# EasyEDA schematic schematic-edited-source.json
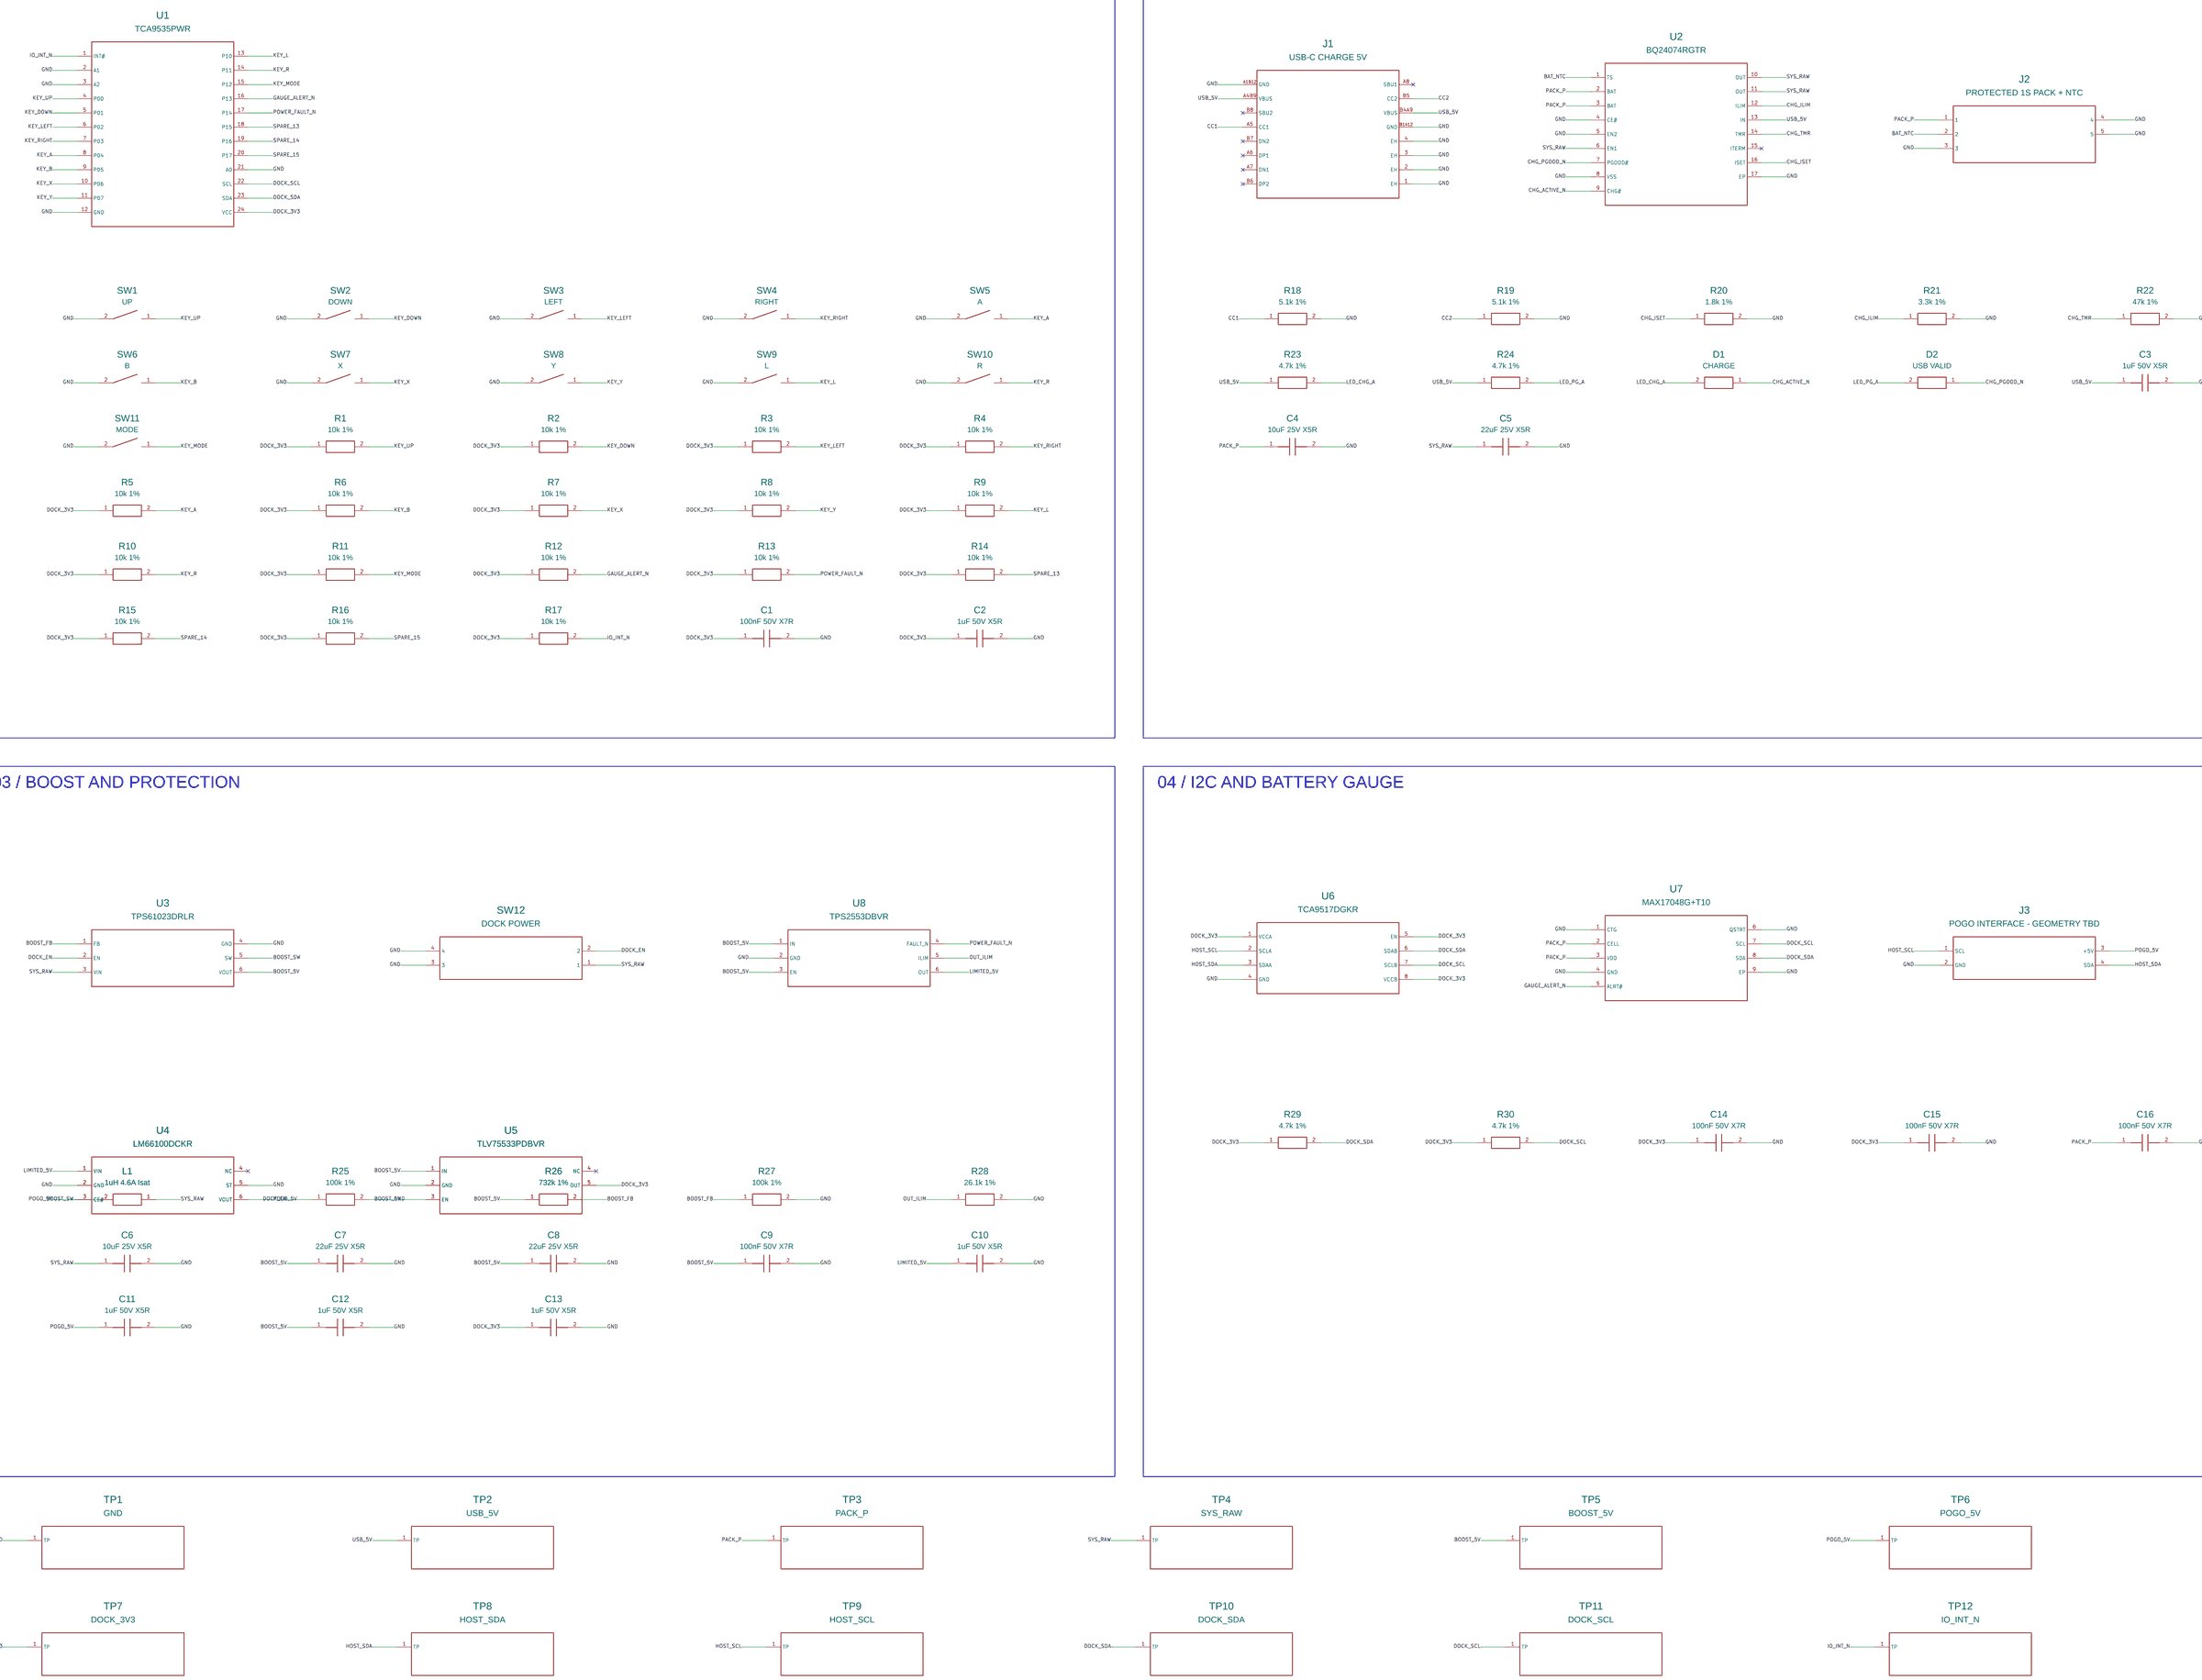
[diagram p0: schematic sheet]

## Parts
C1  100nF 50V X7R  [C0603]
C2  1uF 50V X5R  [C0603]
C3  1uF 50V X5R  [C0603]
C4  10uF 25V X5R  [C0603]
C5  22uF 25V X5R  [C0603]
C6  10uF 25V X5R  [C0603]
C7  22uF 25V X5R  [C0603]
C8  22uF 25V X5R  [C0603]
C9  100nF 50V X7R  [C0603]
C10  1uF 50V X5R  [C0603]
C11  1uF 50V X5R  [C0603]
C12  1uF 50V X5R  [C0603]
C13  1uF 50V X5R  [C0603]
C14  100nF 50V X7R  [C0603]
C15  100nF 50V X7R  [C0603]
C16  100nF 50V X7R  [C0603]
D1  CHARGE  [LED0805-R-RD]
D2  USB VALID  [LED0805-R-RD]
J1  USB-C CHARGE 5V  [USB-C_SMD-TYPE-C-31-M-12_1]
J2  PROTECTED 1S PACK + NTC  [CONN-SMD_B3B-PH-SM4-TB-LF-SN]
J3  POGO INTERFACE - GEOMETRY TBD  [POGO_GEOMETRY_UNVERIFIED]
L1  1uH 4.6A Isat  [IND-SMD_L2.0-W1.6-B]
R1  10k 1%  [R0603]
R2  10k 1%  [R0603]
R3  10k 1%  [R0603]
R4  10k 1%  [R0603]
R5  10k 1%  [R0603]
R6  10k 1%  [R0603]
R7  10k 1%  [R0603]
R8  10k 1%  [R0603]
R9  10k 1%  [R0603]
R10  10k 1%  [R0603]
R11  10k 1%  [R0603]
R12  10k 1%  [R0603]
R13  10k 1%  [R0603]
R14  10k 1%  [R0603]
R15  10k 1%  [R0603]
R16  10k 1%  [R0603]
R17  10k 1%  [R0603]
R18  5.1k 1%  [R0603]
R19  5.1k 1%  [R0603]
R20  1.8k 1%  [R0603]
R21  3.3k 1%  [R0603]
R22  47k 1%  [R0603]
R23  4.7k 1%  [R0603]
R24  4.7k 1%  [R0603]
R25  100k 1%  [R0603]
R26  732k 1%  [R0603]
R27  100k 1%  [R0603]
R28  26.1k 1%  [R0603]
R29  4.7k 1%  [R0603]
R30  4.7k 1%  [R0603]
SW1  UP  [SW-SMD_L3.9-W3.0-P4.45]
SW2  DOWN  [SW-SMD_L3.9-W3.0-P4.45]
SW3  LEFT  [SW-SMD_L3.9-W3.0-P4.45]
SW4  RIGHT  [SW-SMD_L3.9-W3.0-P4.45]
SW5  A  [SW-SMD_L3.9-W3.0-P4.45]
SW6  B  [SW-SMD_L3.9-W3.0-P4.45]
SW7  X  [SW-SMD_L3.9-W3.0-P4.45]
SW8  Y  [SW-SMD_L3.9-W3.0-P4.45]
SW9  L  [SW-SMD_L3.9-W3.0-P4.45]
SW10  R  [SW-SMD_L3.9-W3.0-P4.45]
SW11  MODE  [SW-SMD_L3.9-W3.0-P4.45]
SW12  DOCK POWER  [SW-TH_MSK12C02]
TP1  GND  [TESTPAD_1.0MM]
TP2  USB_5V  [TESTPAD_1.0MM]
TP3  PACK_P  [TESTPAD_1.0MM]
TP4  SYS_RAW  [TESTPAD_1.0MM]
TP5  BOOST_5V  [TESTPAD_1.0MM]
TP6  POGO_5V  [TESTPAD_1.0MM]
TP7  DOCK_3V3  [TESTPAD_1.0MM]
TP8  HOST_SDA  [TESTPAD_1.0MM]
TP9  HOST_SCL  [TESTPAD_1.0MM]
TP10  DOCK_SDA  [TESTPAD_1.0MM]
TP11  DOCK_SCL  [TESTPAD_1.0MM]
TP12  IO_INT_N  [TESTPAD_1.0MM]
U1  TCA9535PWR  [TSSOP-24_L7.8-W4.4-P0.65-LS6.4-BL]
U2  BQ24074RGTR  [QFN-16_L3.0-W3.0-P0.50-TL-EP1.7]
U3  TPS61023DRLR  [SOT-563_L1.6-W1.2-P0.50-LS1.6-BR]
U4  LM66100DCKR  [SC-70-6_L2.0-W1.3-P0.65-LS2.1-BL]
U5  TLV75533PDBVR  [SOT-23-5_L3.0-W1.7-P0.95-LS2.8-BR]
U6  TCA9517DGKR  [VSSOP-8_L3.0-W3.0-P0.65-LS5.0-BL]
U7  MAX17048G+T10  [TDFN-8_L2.0-W2.0-P0.50-BL-EP1.2]
U8  TPS2553DBVR  [SOT-23-6_L2.9-W1.6-P0.95-LS2.8]

## Library data of the parts
C1 C9 C14-C16 = 100nF 50V X7R: Supplier: LCSC; Supplier Part: C1591
C2 C3 C10-C13 = 1uF 50V X5R: Manufacturer Part: CL10A105KB8NNNC; Supplier: LCSC; Supplier Part: C15849; Manufacturer: SAMSUNG(三星); JLCPCB Part Class: Basic Part
C4 C6 = 10uF 25V X5R: Manufacturer Part: CL10A106MA8NRNC; Supplier: LCSC; Supplier Part: C96446; Manufacturer: SAMSUNG(三星); JLCPCB Part Class: Basic Part
C5 C7 C8 = 22uF 25V X5R: Supplier: LCSC; Supplier Part: C45783
D1 = CHARGE: Manufacturer Part: KT-0805黄灯; Supplier: LCSC; Supplier Part: C2296; Manufacturer: KENTO; JLCPCB Part Class: Basic Part
D2 = USB VALID: Manufacturer Part: KT-0805黄灯; Supplier: LCSC; Supplier Part: C2296; Manufacturer: KENTO; JLCPCB Part Class: Basic Part
J1 = USB-C CHARGE 5V: Manufacturer Part: TYPE-C-31-M-12; Supplier: LCSC; Supplier Part: C165948; Manufacturer: 韩国韩荣; JLCPCB Part Class: Extended Part
J2 = PROTECTED 1S PACK + NTC: Manufacturer Part: B3B-PH-SM4-TB(LF)(SN); Supplier: LCSC; Supplier Part: C160353; Manufacturer: JST; JLCPCB Part Class: Extended Part
J3 = POGO INTERFACE - GEOMETRY TBD: Supplier: LCSC
L1 = 1uH 4.6A Isat: Manufacturer Part: FTC201610S1R0MBCA; Supplier: LCSC; Supplier Part: C5832342; Manufacturer: cjiang(长江微电); JLCPCB Part Class: Extended Part
R1-R17 = 10k 1%: Manufacturer Part: 0603WAF1002T5E; Supplier: LCSC; Supplier Part: C25804; Manufacturer: UNI-ROYAL(厚声); JLCPCB Part Class: Basic Part
R18 R19 = 5.1k 1%: Manufacturer Part: 0603WAF5101T5E; Supplier: LCSC; Supplier Part: C23186; Manufacturer: UNI-ROYAL(厚声); JLCPCB Part Class: Basic Part
R20 = 1.8k 1%: Supplier: LCSC; Supplier Part: C4177
R21 = 3.3k 1%: Supplier: LCSC; Supplier Part: C22978
R22 = 47k 1%: Supplier: LCSC; Supplier Part: C25819
R23 R24 R29 R30 = 4.7k 1%: Manufacturer Part: 0603WAF4701T5E; Supplier: LCSC; Supplier Part: C23162; Manufacturer: UNI-ROYAL(厚声); JLCPCB Part Class: Basic Part
R25 R27 = 100k 1%: Manufacturer Part: 0603WAF1003T5E; Supplier: LCSC; Supplier Part: C25803; Manufacturer: UNI-ROYAL(厚声); JLCPCB Part Class: Basic Part
R26 = 732k 1%: Supplier: LCSC; Supplier Part: C23239
R28 = 26.1k 1%: Supplier: LCSC
SW1 = UP: Manufacturer Part: TS-1088-AR02016; Supplier: LCSC; Supplier Part: C720477; Manufacturer: XUNPU(讯普); JLCPCB Part Class: Basic Part
SW2 = DOWN: Manufacturer Part: TS-1088-AR02016; Supplier: LCSC; Supplier Part: C720477; Manufacturer: XUNPU(讯普); JLCPCB Part Class: Basic Part
SW3 = LEFT: Manufacturer Part: TS-1088-AR02016; Supplier: LCSC; Supplier Part: C720477; Manufacturer: XUNPU(讯普); JLCPCB Part Class: Basic Part
SW4 = RIGHT: Manufacturer Part: TS-1088-AR02016; Supplier: LCSC; Supplier Part: C720477; Manufacturer: XUNPU(讯普); JLCPCB Part Class: Basic Part
SW5 = A: Manufacturer Part: TS-1088-AR02016; Supplier: LCSC; Supplier Part: C720477; Manufacturer: XUNPU(讯普); JLCPCB Part Class: Basic Part
SW6 = B: Manufacturer Part: TS-1088-AR02016; Supplier: LCSC; Supplier Part: C720477; Manufacturer: XUNPU(讯普); JLCPCB Part Class: Basic Part
SW7 = X: Manufacturer Part: TS-1088-AR02016; Supplier: LCSC; Supplier Part: C720477; Manufacturer: XUNPU(讯普); JLCPCB Part Class: Basic Part
SW8 = Y: Manufacturer Part: TS-1088-AR02016; Supplier: LCSC; Supplier Part: C720477; Manufacturer: XUNPU(讯普); JLCPCB Part Class: Basic Part
SW9 = L: Manufacturer Part: TS-1088-AR02016; Supplier: LCSC; Supplier Part: C720477; Manufacturer: XUNPU(讯普); JLCPCB Part Class: Basic Part
SW10 = R: Manufacturer Part: TS-1088-AR02016; Supplier: LCSC; Supplier Part: C720477; Manufacturer: XUNPU(讯普); JLCPCB Part Class: Basic Part
SW11 = MODE: Manufacturer Part: TS-1088-AR02016; Supplier: LCSC; Supplier Part: C720477; Manufacturer: XUNPU(讯普); JLCPCB Part Class: Basic Part
SW12 = DOCK POWER: Manufacturer Part: MSK12C02; Supplier: LCSC; Supplier Part: C431540; Manufacturer: SHOU HAN(首韩); JLCPCB Part Class: Extended Part
TP1 = GND: Supplier: LCSC
TP2 = USB_5V: Supplier: LCSC
TP3 = PACK_P: Supplier: LCSC
TP4 = SYS_RAW: Supplier: LCSC
TP5 = BOOST_5V: Supplier: LCSC
TP6 = POGO_5V: Supplier: LCSC
TP7 = DOCK_3V3: Supplier: LCSC
TP8 = HOST_SDA: Supplier: LCSC
TP9 = HOST_SCL: Supplier: LCSC
TP10 = DOCK_SDA: Supplier: LCSC
TP11 = DOCK_SCL: Supplier: LCSC
TP12 = IO_INT_N: Supplier: LCSC
U1 = TCA9535PWR: Supplier: LCSC; Supplier Part: C130204; Manufacturer: TI(德州仪器); JLCPCB Part Class: Extended Part
U2 = BQ24074RGTR: Supplier: LCSC; Supplier Part: C54313; Manufacturer: TI(德州仪器); JLCPCB Part Class: Extended Part
U3 = TPS61023DRLR: Supplier: LCSC; Supplier Part: C919459; Manufacturer: TI(德州仪器); JLCPCB Part Class: Extended Part
U4 = LM66100DCKR: Supplier: LCSC; Supplier Part: C2869734; Manufacturer: TI(德州仪器); JLCPCB Part Class: Extended Part
U5 = TLV75533PDBVR: Supplier: LCSC; Supplier Part: C404027; Manufacturer: TI(德州仪器); JLCPCB Part Class: Extended Part
U6 = TCA9517DGKR: Supplier: LCSC; Supplier Part: C544515; Manufacturer: TI(德州仪器); JLCPCB Part Class: Extended Part
U7 = MAX17048G+T10: Supplier: LCSC; Supplier Part: C2682616; Manufacturer: ADI(亚德诺)/MAXIM(美信); JLCPCB Part Class: Extended Part
U8 = TPS2553DBVR: Supplier: LCSC; Supplier Part: C55266

## Nets
GND: C1.2 C2.2 C3.2 C4.2 C5.2 C6.2 C7.2 C8.2 C9.2 C10.2 C11.2 C12.2 C13.2 C14.2 C15.2 C16.2 J1.1(EH) J1.2(EH) J1.3(EH) J1.4(EH) J1.A1B12(GND) J1.B1A12(GND) J2.3 J2.4 J2.5 J3.2(GND) R18.2 R19.2 R20.2 R21.2 R22.2 R25.2 R27.2 R28.2 SW1.2 SW2.2 SW3.2 SW4.2 SW5.2 SW6.2 SW7.2 SW8.2 SW9.2 SW10.2 SW11.2 SW12.3 SW12.4 TP1.1(TP) U1.2(A1) U1.3(A2) U1.12(GND) U1.21(A0) U2.4(CE#) U2.5(EN2) U2.8(VSS) U2.17(EP) U3.4(GND) U4.2(GND) U4.5(ST) U5.2(GND) U6.4(GND) U7.1(CTG) U7.4(GND) U7.6(QSTRT) U7.9(EP) U8.2(GND)
BAT_NTC: J2.2 U2.1(TS)
BOOST_5V: C7.1 C8.1 C9.1 C12.1 R26.1 TP5.1(TP) U3.6(VOUT) U5.1(IN) U5.3(EN) U8.1(IN) U8.3(EN)
BOOST_FB: R26.2 R27.1 U3.1(FB)
BOOST_SW: C11.1 J3.3(+5V) L1.2 TP6.1(TP) U3.5(SW) U4.3(CE#) U4.6(VOUT)
CC1: J1.A5(CC1) R18.1
CC2: J1.B5(CC2) R19.1
CHG_ACTIVE_N: D1.1 U2.9(CHG#)
CHG_ILIM: R21.1 U2.12(ILIM)
CHG_ISET: R20.1 U2.16(ISET)
CHG_PGOOD_N: D2.1 U2.7(PGOOD#)
CHG_TMR: R22.1 U2.14(TMR)
DOCK_3V3: C1.1 C2.1 C13.1 C14.1 C15.1 R1.1 R2.1 R3.1 R4.1 R5.1 R6.1 R7.1 R8.1 R9.1 R10.1 R11.1 R12.1 R13.1 R14.1 R15.1 R16.1 R17.1 R29.1 R30.1 TP7.1(TP) U1.24(VCC) U5.5(OUT) U6.1(VCCA) U6.5(EN) U6.8(VCCB)
DOCK_EN: R25.1 SW12.2 U3.2(EN)
DOCK_SCL: R30.2 TP11.1(TP) U1.22(SCL) U6.7(SCLB) U7.7(SCL)
DOCK_SDA: R29.2 TP10.1(TP) U1.23(SDA) U6.6(SDAB) U7.8(SDA)
GAUGE_ALERT_N: R12.2 U1.16(P13) U7.5(ALRT#)
HOST_SCL: J3.1(SCL) TP9.1(TP) U6.2(SCLA)
HOST_SDA: J3.4(SDA) TP8.1(TP) U6.3(SDAA)
IO_INT_N: R17.2 TP12.1(TP) U1.1(INT#)
KEY_A: R5.2 SW5.1 U1.8(P04)
KEY_B: R6.2 SW6.1 U1.9(P05)
KEY_DOWN: R2.2 SW2.1 U1.5(P01)
KEY_L: R9.2 SW9.1 U1.13(P10)
KEY_LEFT: R3.2 SW3.1 U1.6(P02)
KEY_MODE: R11.2 SW11.1 U1.15(P12)
KEY_R: R10.2 SW10.1 U1.14(P11)
KEY_RIGHT: R4.2 SW4.1 U1.7(P03)
KEY_UP: R1.2 SW1.1 U1.4(P00)
KEY_X: R7.2 SW7.1 U1.10(P06)
KEY_Y: R8.2 SW8.1 U1.11(P07)
LED_CHG_A: D1.2 R23.2
LED_PG_A: D2.2 R24.2
LIMITED_5V: C10.1 U4.1(VIN) U8.6(OUT)
OUT_ILIM: R28.1 U8.5(ILIM)
PACK_P: C4.1 C16.1 J2.1 TP3.1(TP) U2.2(BAT) U2.3(BAT) U7.2(CELL) U7.3(VDD)
POWER_FAULT_N: R13.2 U1.17(P14) U8.4(FAULT_N)
SPARE_13: R14.2 U1.18(P15)
SPARE_14: R15.2 U1.19(P16)
SPARE_15: R16.2 U1.20(P17)
SYS_RAW: C5.1 C6.1 L1.1 SW12.1 TP4.1(TP) U2.6(EN1) U2.10(OUT) U2.11(OUT) U3.3(VIN)
USB_5V: C3.1 J1.A4B9(VBUS) J1.B4A9(VBUS) R23.1 R24.1 TP2.1(TP) U2.13(IN)

Not connected (* = marked no-connect by the designer): J1 A6(DP1)* A7(DN1)* A8(SBU1)* B6(DP2)* B7(DN2)* B8(SBU2)*; U2 15(ITERM)*; U4 4(NC)*; U5 4(NC)*

## Notes on the sheet
- T02 EDIT CHECK - NOT FOR FABRICATION
- NOT FOR FABRICATION: mechanical interface, battery selection, component sourcing and electrical validation remain open.
- 01 / INPUTS
- 02 / USB-C AND CHARGER
- 03 / BOOST AND PROTECTION
- 04 / I2C AND BATTERY GAUGE
